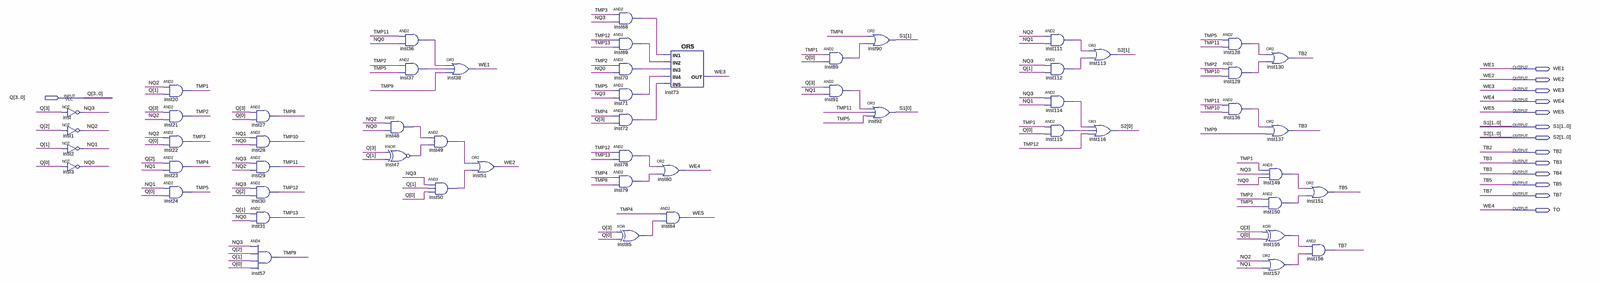
[diagram p0: schematic sheet, whole]
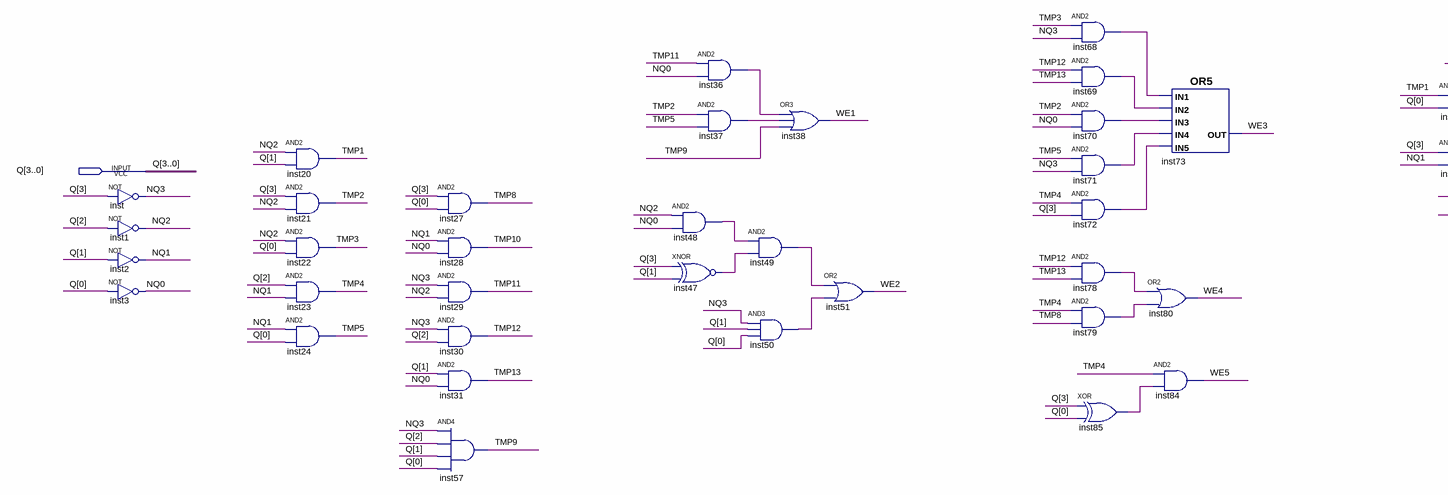
[diagram p1: schematic sheet, left part]
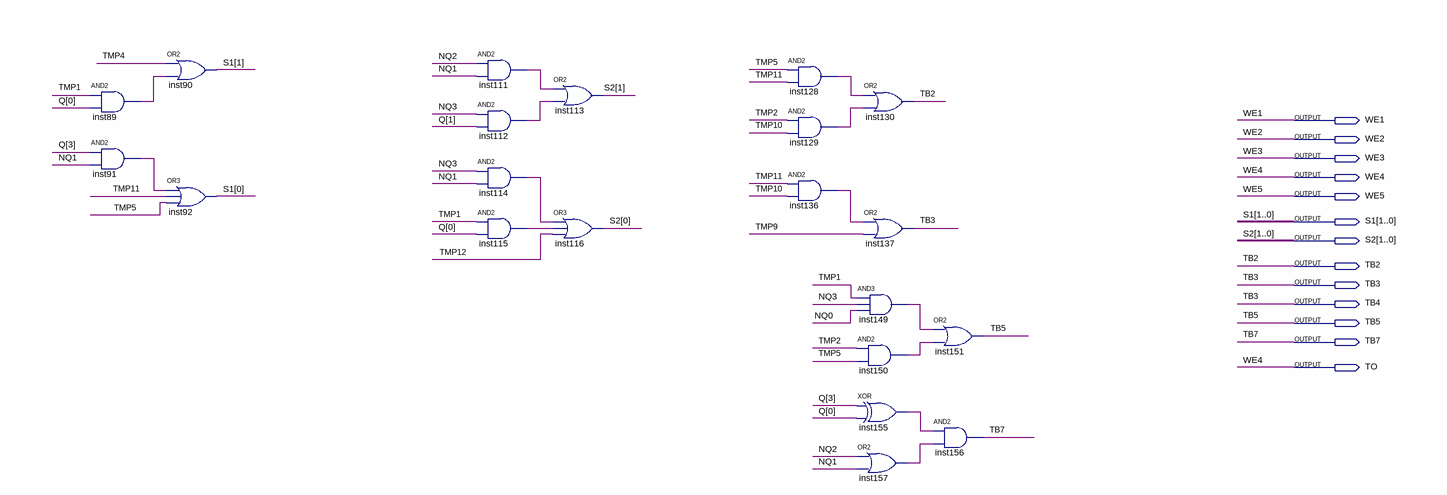
[diagram p2: schematic sheet, right part]
// Quartus schematic OutputBlock2.bdf as structural Verilog: 55 symbols, 14 pins
module OutputBlock2 (
  input  [3:0] Q,
  output WE1,
  output WE2,
  output WE3,
  output WE4,
  output WE5,
  output [1:0] S1,
  output [1:0] S2,
  output TB2,
  output TB3,
  output TB4,
  output TB5,
  output TB7,
  output TO
);

  wire inst36_out, inst37_out, inst47_out, inst48_out, inst49_out, inst50_out, inst68_out, inst69_out,
       inst70_out, inst71_out, inst72_out, inst78_out, inst79_out, inst85_out, inst89_out, inst91_out,
       inst111_out, inst112_out, inst114_out, inst115_out, inst128_out, inst129_out, inst136_out,
       inst149_out, inst150_out, inst155_out, inst157_out, NQ0, NQ1, NQ2, NQ3, TMP1, TMP2, TMP3, TMP4, TMP5,
       TMP8, TMP9, TMP10, TMP11, TMP12, TMP13;

  not inst (NQ3, Q[3]);
  not inst1 (NQ2, Q[2]);
  not inst2 (NQ1, Q[1]);
  not inst3 (NQ0, Q[0]);
  and inst20 (TMP1, NQ2, Q[1]);
  and inst21 (TMP2, Q[3], NQ2);
  and inst22 (TMP3, NQ2, Q[0]);
  and inst23 (TMP4, Q[2], NQ1);
  and inst24 (TMP5, NQ1, Q[0]);
  and inst27 (TMP8, Q[3], Q[0]);
  and inst28 (TMP10, NQ1, NQ0);
  and inst29 (TMP11, NQ3, NQ2);
  and inst30 (TMP12, NQ3, Q[2]);
  and inst31 (TMP13, Q[1], NQ0);
  and inst57 (TMP9, NQ3, Q[2], Q[1], Q[0]);
  and inst48 (inst48_out, NQ2, NQ0);
  xnor inst47 (inst47_out, Q[3], Q[1]);
  and inst36 (inst36_out, TMP11, NQ0);
  and inst37 (inst37_out, TMP2, TMP5);
  or inst38 (WE1, inst36_out, inst37_out, TMP9);
  and inst49 (inst49_out, inst48_out, inst47_out);
  and inst50 (inst50_out, NQ3, Q[1], Q[0]);
  or inst51 (WE2, inst49_out, inst50_out);
  and inst68 (inst68_out, TMP3, NQ3);
  and inst69 (inst69_out, TMP12, TMP13);
  and inst70 (inst70_out, TMP2, NQ0);
  and inst71 (inst71_out, TMP5, NQ3);
  and inst72 (inst72_out, TMP4, Q[3]);
  and inst78 (inst78_out, TMP12, TMP13);
  and inst79 (inst79_out, TMP4, TMP8);
  xor inst85 (inst85_out, Q[3], Q[0]);
  or inst73 (WE3, inst68_out, inst69_out, inst70_out, inst71_out, inst72_out);
  or inst80 (TO, inst78_out, inst79_out);
  and inst84 (WE5, TMP4, inst85_out);
  and inst89 (inst89_out, TMP1, Q[0]);
  and inst91 (inst91_out, Q[3], NQ1);
  or inst90 (S1[1], TMP4, inst89_out);
  or inst92 (S1[0], inst91_out, TMP11, TMP5);
  and inst111 (inst111_out, NQ2, NQ1);
  and inst112 (inst112_out, NQ3, Q[1]);
  and inst114 (inst114_out, NQ3, NQ1);
  and inst115 (inst115_out, TMP1, Q[0]);
  or inst113 (S2[1], inst111_out, inst112_out);
  or inst116 (S2[0], inst114_out, inst115_out, TMP12);
  and inst128 (inst128_out, TMP5, TMP11);
  and inst129 (inst129_out, TMP2, TMP10);
  and inst136 (inst136_out, TMP11, TMP10);
  or inst130 (TB2, inst128_out, inst129_out);
  or inst137 (TB3, inst136_out, TMP9);
  and inst149 (inst149_out, TMP1, NQ3, NQ0);
  and inst150 (inst150_out, TMP2, TMP5);
  xor inst155 (inst155_out, Q[3], Q[0]);
  or inst157 (inst157_out, NQ2, NQ1);
  or inst151 (TB5, inst149_out, inst150_out);
  and inst156 (TB7, inst155_out, inst157_out);

  assign TB4 = TB3;
  assign WE4 = TO;
endmodule
